# EAGLE design 8051 with lcd (EAGLE 6.5.0)
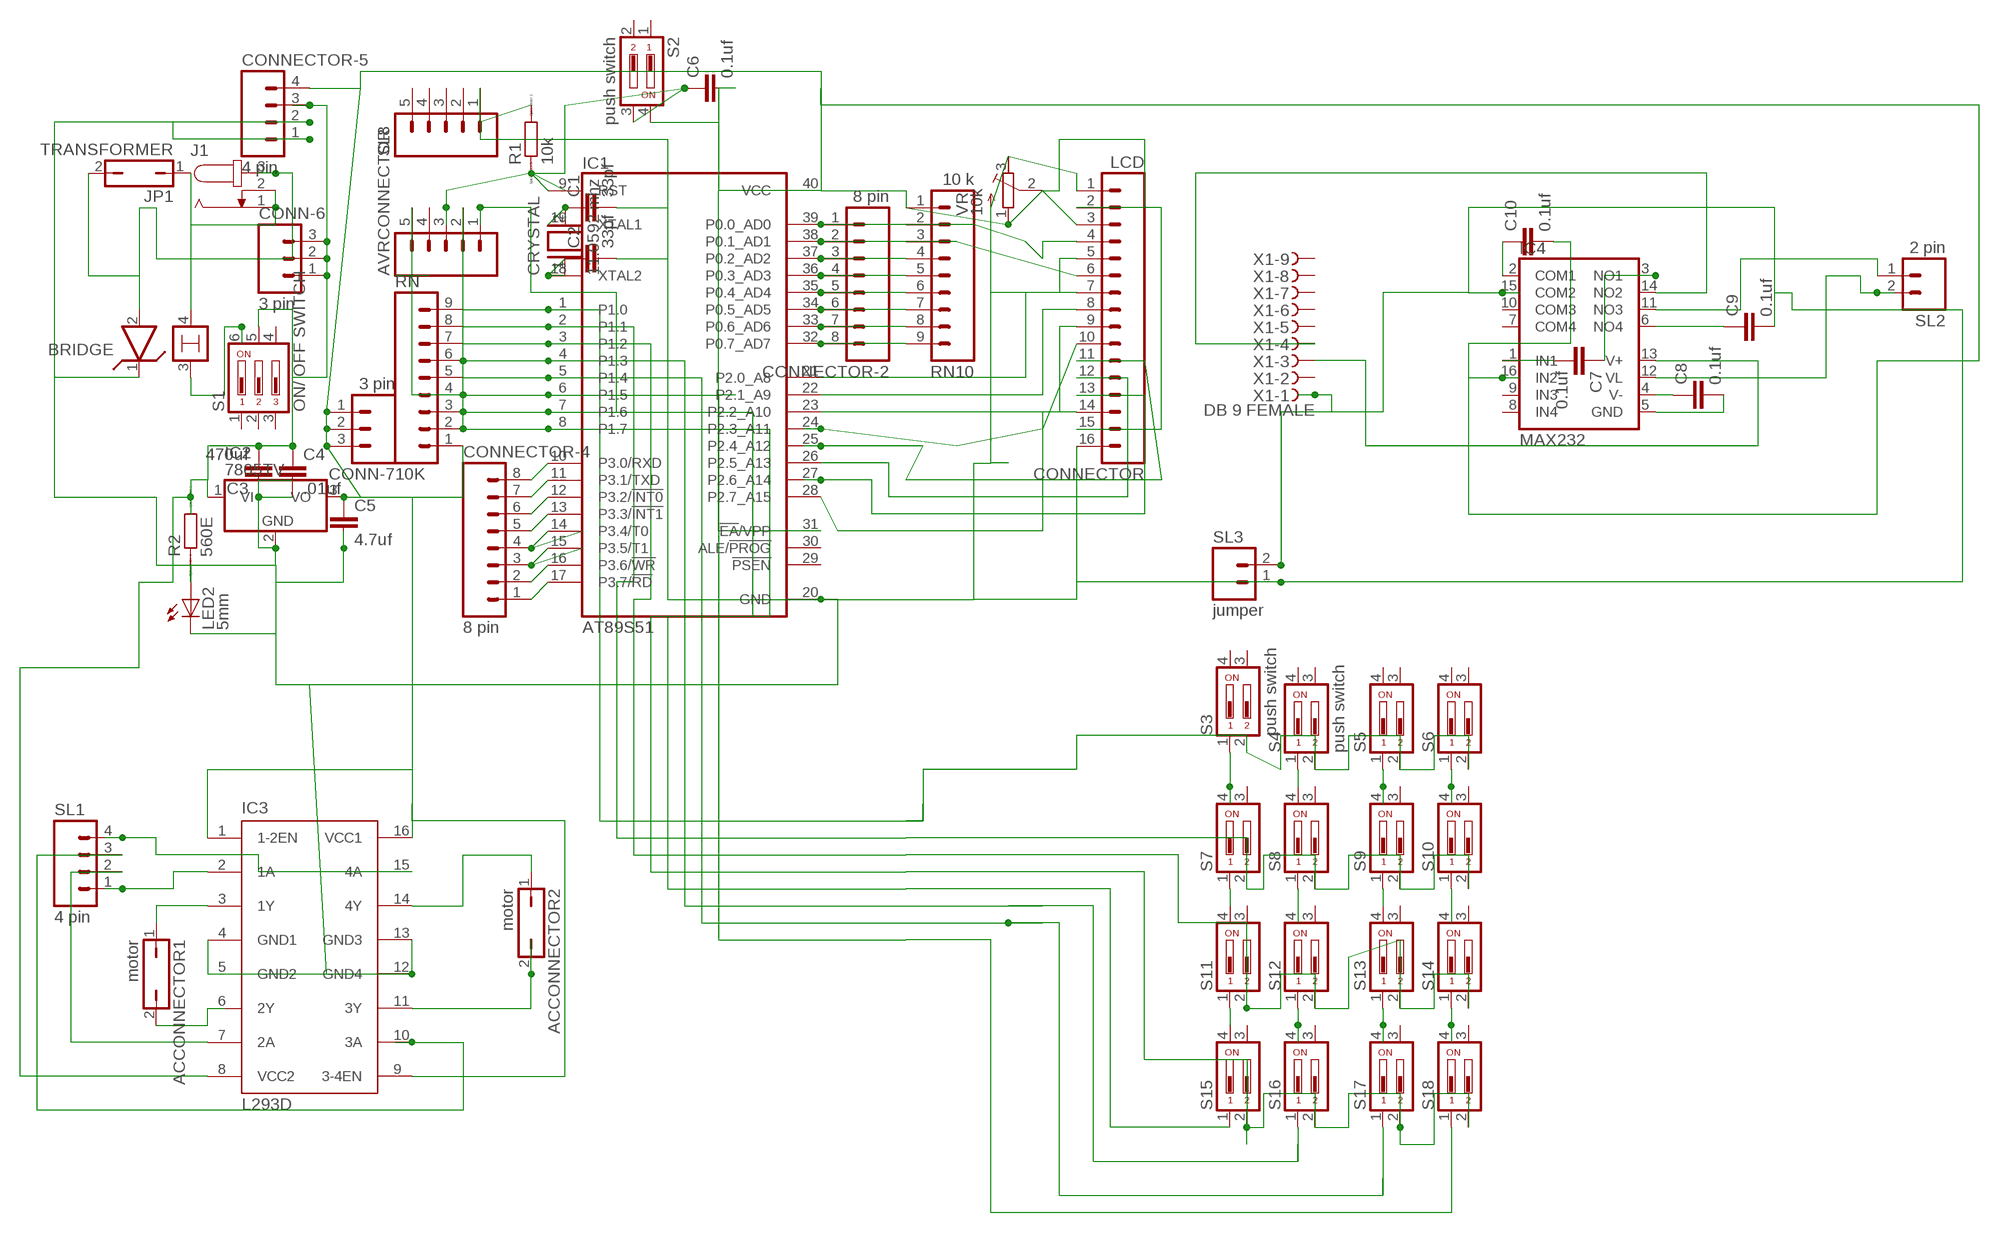
[diagram p0: schematic, sheet 1]

## Parts
ACCONNECTOR1  motor  JP1Q  [JP1]
ACCONNECTOR2  motor  JP1Q  [JP1]
AVRCONNECTOR  M05  [05P]
BRIDGE  LM399H  [TO39/4]
C1  33pf  C-EU025-024X044  [C025-024X044]
C2  33pf  C-EU025-024X044  [C025-024X044]
C3  470uf  C5/7.2  [C5B7.2]
C4  .01uf  C2,5-3  [C2.5-3]
C5  4.7uf  C2,5-3  [C2.5-3]
C6  0.1uf  C2.5/6  [C2.5-6]
C7  0.1uf  C2,5-3  [C2.5-3]
C8  0.1uf  C2,5-3  [C2.5-3]
C9  0.1uf  C2,5-3  [C2.5-3]
C10  0.1uf  C2,5-3  [C2.5-3]
CONN-6  3 pin  M03  [03P]
CONN-7  3 pin  M03  [03P]
CONNECTOR  LCD  M16  [16P]
CONNECTOR-2  8 pin  M08  [08P]
CONNECTOR-4  8 pin  M08  [08P]
CONNECTOR-5  4 pin  M04  [04P]
CRYSTAL  11.0592 mhz  XTAL/S  [QS]
IC1  AT89S51  AT89C51-12PC  [DIL40]
IC2  7805TV  [TO220V]
IC3  L293D  [DIL16]
IC4  MAX232  MAX313EPE  [DIL16]
J1  JACK-PLUG0  [SPC4077]
JP1  TRANSFORMER  JP1Q  [JP1]
LED2  5mm  LED5MM  [LED5MM]
R1  10k  R0204/7  [0204/7]
R2  560E  R0204/7  [0204/7]
RN  10K  M09  [09P]
RN10  10 k  M09  [09P]
S1  ON/ OFF SWITCH  DA03  [DA-03]
S2  push switch  DP02  [DP-02]
S3  push switch  DP02  [DP-02]
S4  push switch  DP02  [DP-02]
S5  DP02  [DP-02]
S6  DP02  [DP-02]
S7  DP02  [DP-02]
S8  DP02  [DP-02]
S9  DP02  [DP-02]
S10  DP02  [DP-02]
S11  DP02  [DP-02]
S12  DP02  [DP-02]
S13  DP02  [DP-02]
S14  DP02  [DP-02]
S15  DP02  [DP-02]
S16  DP02  [DP-02]
S17  DP02  [DP-02]
S18  DP02  [DP-02]
SL1  4 pin  M04  [04P]
SL2  2 pin  M02  [02P]
SL3  jumper  M02  [02P]
SL8  M05  [05P]
VR  10k  R-TRIMM64P  [RTRIM64P]
X1  DB 9 FEMALE  D-SUB9-H2M09ST  [H2M09ST]

## Nets
N$1: C2.1 CRYSTAL.1 IC1.18(XTAL2)
N$2: C1.1 CRYSTAL.2 IC1.19(XTAL1)
N$3: S3.2 S4.2 S5.2 S6.2
N$4: C7.2 IC4.1(IN1)
N$5: BRIDGE.2 J1.3 JP1.2
N$6: CONNECTOR-4.8 IC1.10(P3.0/RXD)
N$7: CONNECTOR-4.7 IC1.11(P3.1/TXD)
N$8: CONNECTOR-4.6 IC1.12(P3.2/!INT0)
N$9: CONNECTOR-4.5 IC1.13(P3.3/!INT1)
N$10: CONNECTOR-4.4 IC1.14(P3.4/T0)
N$11: CONNECTOR-4.3 IC1.15(P3.5/T1)
N$12: CONNECTOR-4.2 IC1.16(P3.6/!WR)
N$13: CONNECTOR-4.1 IC1.17(P3.7/!RD)
N$14: AVRCONNECTOR.3 C6.1 IC1.9(RST) R1.1 S2.3
N$15: AVRCONNECTOR.5 IC1.6(P1.5) RN.4
N$16: BRIDGE.4 J1.1 J1.2 JP1.1
N$17: IC1.5(P1.4) RN.5 S15.1
N$18: IC1.4(P1.3) RN.6 S15.2 S16.2 S17.2 S18.2
N$19: IC1.3(P1.2) RN.7 S11.2 S12.2 S13.2 S14.2
N$20: IC1.2(P1.1) RN.8 S7.2 S8.2 S9.2 S10.2
N$21: IC1.1(P1.0) RN.9
N$22: S16.1
N$23: C7.1 IC4.3(NO1)
N$24: CONNECTOR-2.3 IC1.37(P0.2_AD2) RN10.4
N$25: CONNECTOR-2.4 IC1.36(P0.3_AD3) RN10.5
N$26: CONNECTOR-2.5 IC1.35(P0.4_AD4) RN10.6
N$27: CONNECTOR-2.6 IC1.34(P0.5_AD5) RN10.7
N$28: CONNECTOR-2.7 IC1.33(P0.6_AD6) RN10.8
N$29: CONNECTOR-2.8 IC1.32(P0.7_AD7) RN10.9
N$30: CONNECTOR.7 IC1.21(P2.0_A8)
N$31: CONNECTOR.8 IC1.22(P2.1_A9)
N$32: CONNECTOR.9 IC1.23(P2.2_A10)
N$33: S3.1 S7.4
N$34: S7.1 S11.4
N$35: CONNECTOR.12 IC1.26(P2.5_A13)
N$36: S11.1 S15.4
N$37: S8.1 S12.4
N$38: CONNECTOR.3 VR.2(S)
N$40: S12.1 S16.4
N$41: IC3.2(1A) SL1.1
N$42: AVRCONNECTOR.1 IC1.7(P1.6) RN.3 S17.1
N$43: C3.2 C4.1 CONN-6.1 CONN-6.2 CONN-6.3 CONNECTOR-5.3 IC2.1(VI) IC3.8(VCC2) R2.2 S1.5
N$44: S13.1 S17.4
N$45: AVRCONNECTOR.2 IC1.8(P1.7) RN.2 S18.1
N$47: BRIDGE.3 S1.6
N$48: CONNECTOR-2.2 CONNECTOR.6 IC1.38(P0.1_AD1) RN10.3
N$49: S14.1 S18.4
N$50: S10.1 S14.4
N$51: CONNECTOR.10 IC1.24(P2.3_A11)
N$52: CONNECTOR.11 IC1.25(P2.4_A12)
N$53: C8.1 IC4.4(V-)
N$54: CONNECTOR.13 IC1.27(P2.6_A14)
N$55: CONNECTOR.14 IC1.28(P2.7_A15)
N$57: ACCONNECTOR1.1 IC3.3(1Y)
N$58: CONNECTOR-2.1 CONNECTOR.4 IC1.39(P0.0_AD0) RN10.2
N$59: ACCONNECTOR1.2 IC3.6(2Y)
N$60: ACCONNECTOR2.1 IC3.14(4Y)
N$61: ACCONNECTOR2.2 IC3.11(3Y)
N$62: S4.1 S8.4
N$63: S5.1 S9.4
N$64: S6.1 S10.4
N$65: S9.1 S13.4
N$66: IC3.7(2A) SL1.2
N$67: IC3.10(3A) SL1.3
N$68: IC3.15(4A) SL1.4
N$69: C8.2 IC4.5(GND)
N$70: C9.1 IC4.6(NO4)
N$71: LED2.A R2.1
N$72: BRIDGE.1 C1.2 C2.2 C3.1 C4.2 C5.2 C9.2 CONNECTOR-5.1 CONNECTOR-5.2 CONNECTOR.1 CONNECTOR.5 CONNECTOR.16 IC1.20(GND) IC2.2(GND) IC3.4(GND1) IC3.5(GND2) IC3.12(GND4) IC3.13(GND3) IC4.15(COM2) LED2.K(C) R1.2 SL3.1 SL3.2 SL8.1 VR.3(A) X1.1
N$73: C10.1 IC4.2(COM1)
N$74: C5.1 C6.2 C10.2 CONN-7.1 CONN-7.2 CONN-7.3 CONNECTOR-5.4 CONNECTOR.2 CONNECTOR.15 IC1.31(!EA!/VPP) IC1.40(VCC) IC2.3(VO) IC3.1(1-2EN) IC3.9(3-4EN) IC3.16(VCC1) IC4.16(IN2) RN10.1 RN.1 S2.4 VR.1(E)
N$75: IC4.13(V+) X1.3
N$76: IC4.14(NO2) X1.4
N$77: IC4.11(NO3) SL2.1
N$78: IC4.12(VL) SL2.2
Unconnected: AVRCONNECTOR.4 IC1.29(!PSEN) IC1.30(ALE/!PROG) IC4.7(COM4) IC4.8(IN4) IC4.9(IN3) IC4.10(COM3) S1.1 S1.2 S1.3 S1.4 S2.1 S2.2 S3.3 S3.4 S4.3 S4.4 S5.3 S5.4 S6.3 S6.4 S7.3 S8.3 S9.3 S10.3 S11.3 S12.3 S13.3 S14.3 S15.3 S16.3 S17.3 S18.3 SL8.2 SL8.3 SL8.4 SL8.5 X1.2 X1.5 X1.6 X1.7 X1.8 X1.9

## Library data of the parts
ACCONNECTOR1 ACCONNECTOR2 JP1 = jumper:JP1Q: JUMPER
AVRCONNECTOR SL8 = con-amp-quick:M05: AMP QUICK CONNECTOR; OC_FARNELL: unknown; OC_NEWARK: unknown
BRIDGE = linear:LM399H: Precision Z DIODE
C1 C2 = rcl:C-EU: CAPACITOR, European symbol
C3-C10 = capacitor-wima:C: CAPACITOR naming: grid - package width
CONN-6 CONN-7 = con-amp-quick:M03: AMP QUICK CONNECTOR; OC_FARNELL: unknown; OC_NEWARK: unknown
CONNECTOR = con-amp-quick:M16: AMP QUICK CONNECTOR; OC_FARNELL: unknown; OC_NEWARK: unknown
CONNECTOR-2 CONNECTOR-4 = con-amp-quick:M08: AMP QUICK CONNECTOR; OC_FARNELL: unknown; OC_NEWARK: unknown
CONNECTOR-5 SL1 = con-amp-quick:M04: AMP QUICK CONNECTOR; OC_FARNELL: unknown; OC_NEWARK: unknown
CRYSTAL = special:XTAL/S: CRYSTAL
IC1 = atmel:AT89C51-*: 8-bit Microcontroller with 4K Bytes Flash Not Recommended for New Designs. Use AT89S51. Source: http://www.atmel.com/dyn/resources/prod_documents/doc0265.; OC_FARNELL: unknown; OC_NEWARK: unknown
IC2 = linear:78*: Positive VOLTAGE REGULATOR Source: http://cache.national.com/ds/LM/LM78L05.pdf http://www.fairchildsemi.com/ds/LM/LM7805.pdf
IC3 = st-microelectronics:L293D: PUSH-PULL 4 CHANNEL DRIVER; MPN: L293D; OC_FARNELL: 9589619; OC_NEWARK: 56P8249
IC4 = maxim:MAX313: 10?, Quad, SPST, CMOS Analog Switches Source: http://datasheets.maxim-ic.com/en/ds/MAX312-MAX314.pdf; MPN: MAX313EPE+; OC_FARNELL: unknown; OC_NEWARK: 99K3220
J1 = con-jack:JACK-PLUG: DC POWER JACK Power Jack, DC, Right Angle, Through Hole, Rated 5A at 16VDC, PC Terminals Distributor: Farnell (www.Farnell.de) Drawing: 84N1161.pdf / 84N1162.pdf Manufacturer: SPC Technology (www.spctechnology.com) Type: SPC4077 / SPC 4078; OC_FARNELL: unknown; OC_NEWARK: unknown
LED2 = led:LED: LED OSRAM: - CHIPLED LG R971, LG N971, LY N971, LG Q971, LY Q971, LO R971, LY R971 LH N974, LH R974 LS Q976, LO Q976, LY Q976 LO Q996 - Hyper CHIPLED LW Q18S LB Q993, LB Q99A, LB R99A - SideLED LS A670, LO A670, LY A670, LG A670, LP A670 LB A673, LV A673, LT A673, LW A673 LH A674 LY A675 LS A676, LA A676, LO A676, LY A676, LW A676 LS A679, LY A679, LG A679 - Hyper Micro SIDELED® LS Y876, LA Y876, LO Y876, LY Y876 LT Y87S - SmartLED LW L88C, LW L88S LB L89C, LB L89S, LG L890 LS L89K, LO L89K, LY L89K LS L896, LA L896, LO L896, LY L896 - TOPLED LS T670, LO T670, LY T670, LG T670, LP T670 LSG T670, LSP T670, LSY T670, LOP T670, LYG T670 LG T671, LOG T671, LSG T671 LB T673, LV T673, LT T673, LW T673 LH T674 LS T676, LA T676, LO T676, LY T676, LB T676, LH T676, LSB T676, LW T676 LB T67C, LV T67C, LT T67C, LS T67K, LO T67K, LY T67K, LW E67C LS E67B, LA E67B, LO E67B, LY E67B, LB E67C, LV E67C, LT E67C LW T67C LS T679, LY T679, LG T679 LS T770, LO T770, LY T770, LG T770, LP T770 LB T773, LV T773, LT T773, LW T773 LH T774 LS E675, LA E675, LY E675, LS T675 LS T776, LA T776, LO T776, LY T776, LB T776 LHGB T686 LT T68C, LB T68C - Hyper Mini TOPLED® LB M676 - Mini TOPLED Santana® LG M470 LS M47K, LO M47K, LY M47K Source: http://www.osram.convergy.de LUXEON: - LUMILED® LXK2-PW12-R00, LXK2-PW12-S00, LXK2-PW14-U00, LXK2-PW14-V00 LXK2-PM12-R00, LXK2-PM12-S00, LXK2-PM14-U00 LXK2-PE12-Q00, LXK2-PE12-R00, LXK2-PE12-S00, LXK2-PE14-T00, LXK2-PE14-U00 LXK2-PB12-K00, LXK2-PB12-L00, LXK2-PB12-M00, LXK2-PB14-N00, LXK2-PB14-P00, LXK2-PB14-Q00 LXK2-PR12-L00, LXK2-PR12-M00, LXK2-PR14-Q00, LXK2-PR14-R00 LXK2-PD12-Q00, LXK2-PD12-R00, LXK2-PD12-S00 LXK2-PH12-R00, LXK2-PH12-S00 LXK2-PL12-P00, LXK2-PL12-Q00, LXK2-PL12-R00 Source: www.luxeon.com KINGBRIGHT: KA-3528ASYC Source: www.kingbright.com
R1 R2 = eagle-ltspice:R: RESISTOR, European symbol; SPICEMODEL: NONE; SPICEPREFIX: R
RN RN10 = con-amp-quick:M09: AMP QUICK CONNECTOR; OC_FARNELL: unknown; OC_NEWARK: unknown
S1 = switch-dil:DA03: DIL/CODE SWITCH; MPN: MCDA03; OC_FARNELL: 1521999; OC_NEWARK: 74M2972
S2-S18 = switch-dil:DP02: DIL/CODE SWITCH; MPN: MCDP02; OC_FARNELL: 1255233; OC_NEWARK: 26M1095
SL2 SL3 = con-amp-quick:M02: AMP QUICK CONNECTOR; OC_FARNELL: unknown; OC_NEWARK: unknown
VR = resistor:R-TRIMM: Trimm resistor
X1 = con-thomas-betts:D-SUB9-: D-Subminiatur Connector Source: Electronioc Interconnects European Edition 1998; OC_FARNELL: unknown; OC_NEWARK: unknown

## Board
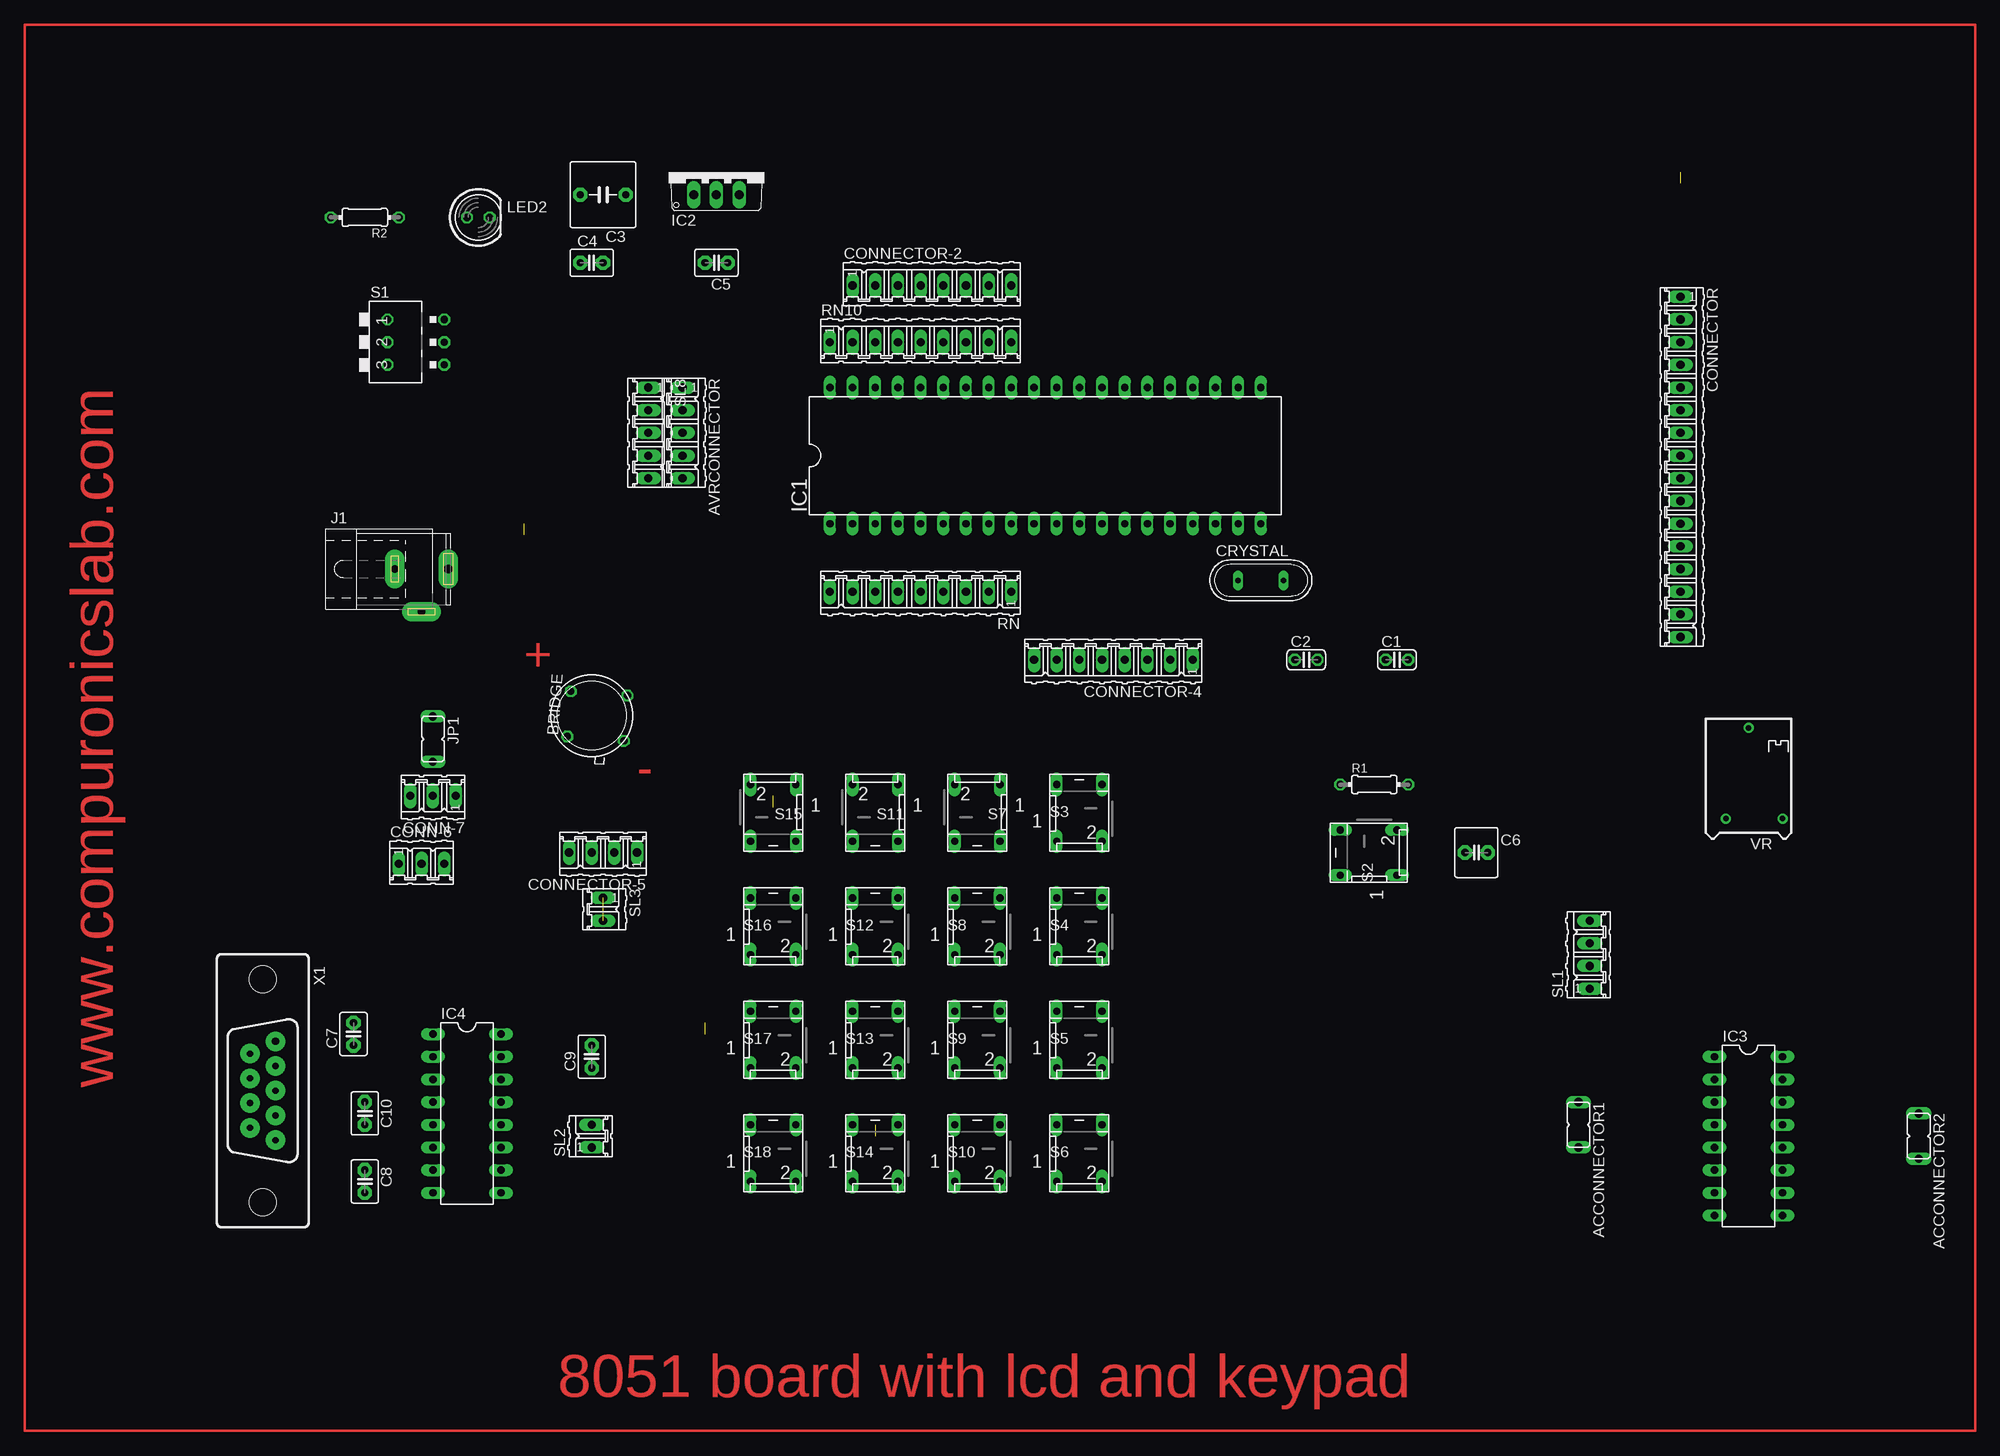
[diagram p1: board, top side]
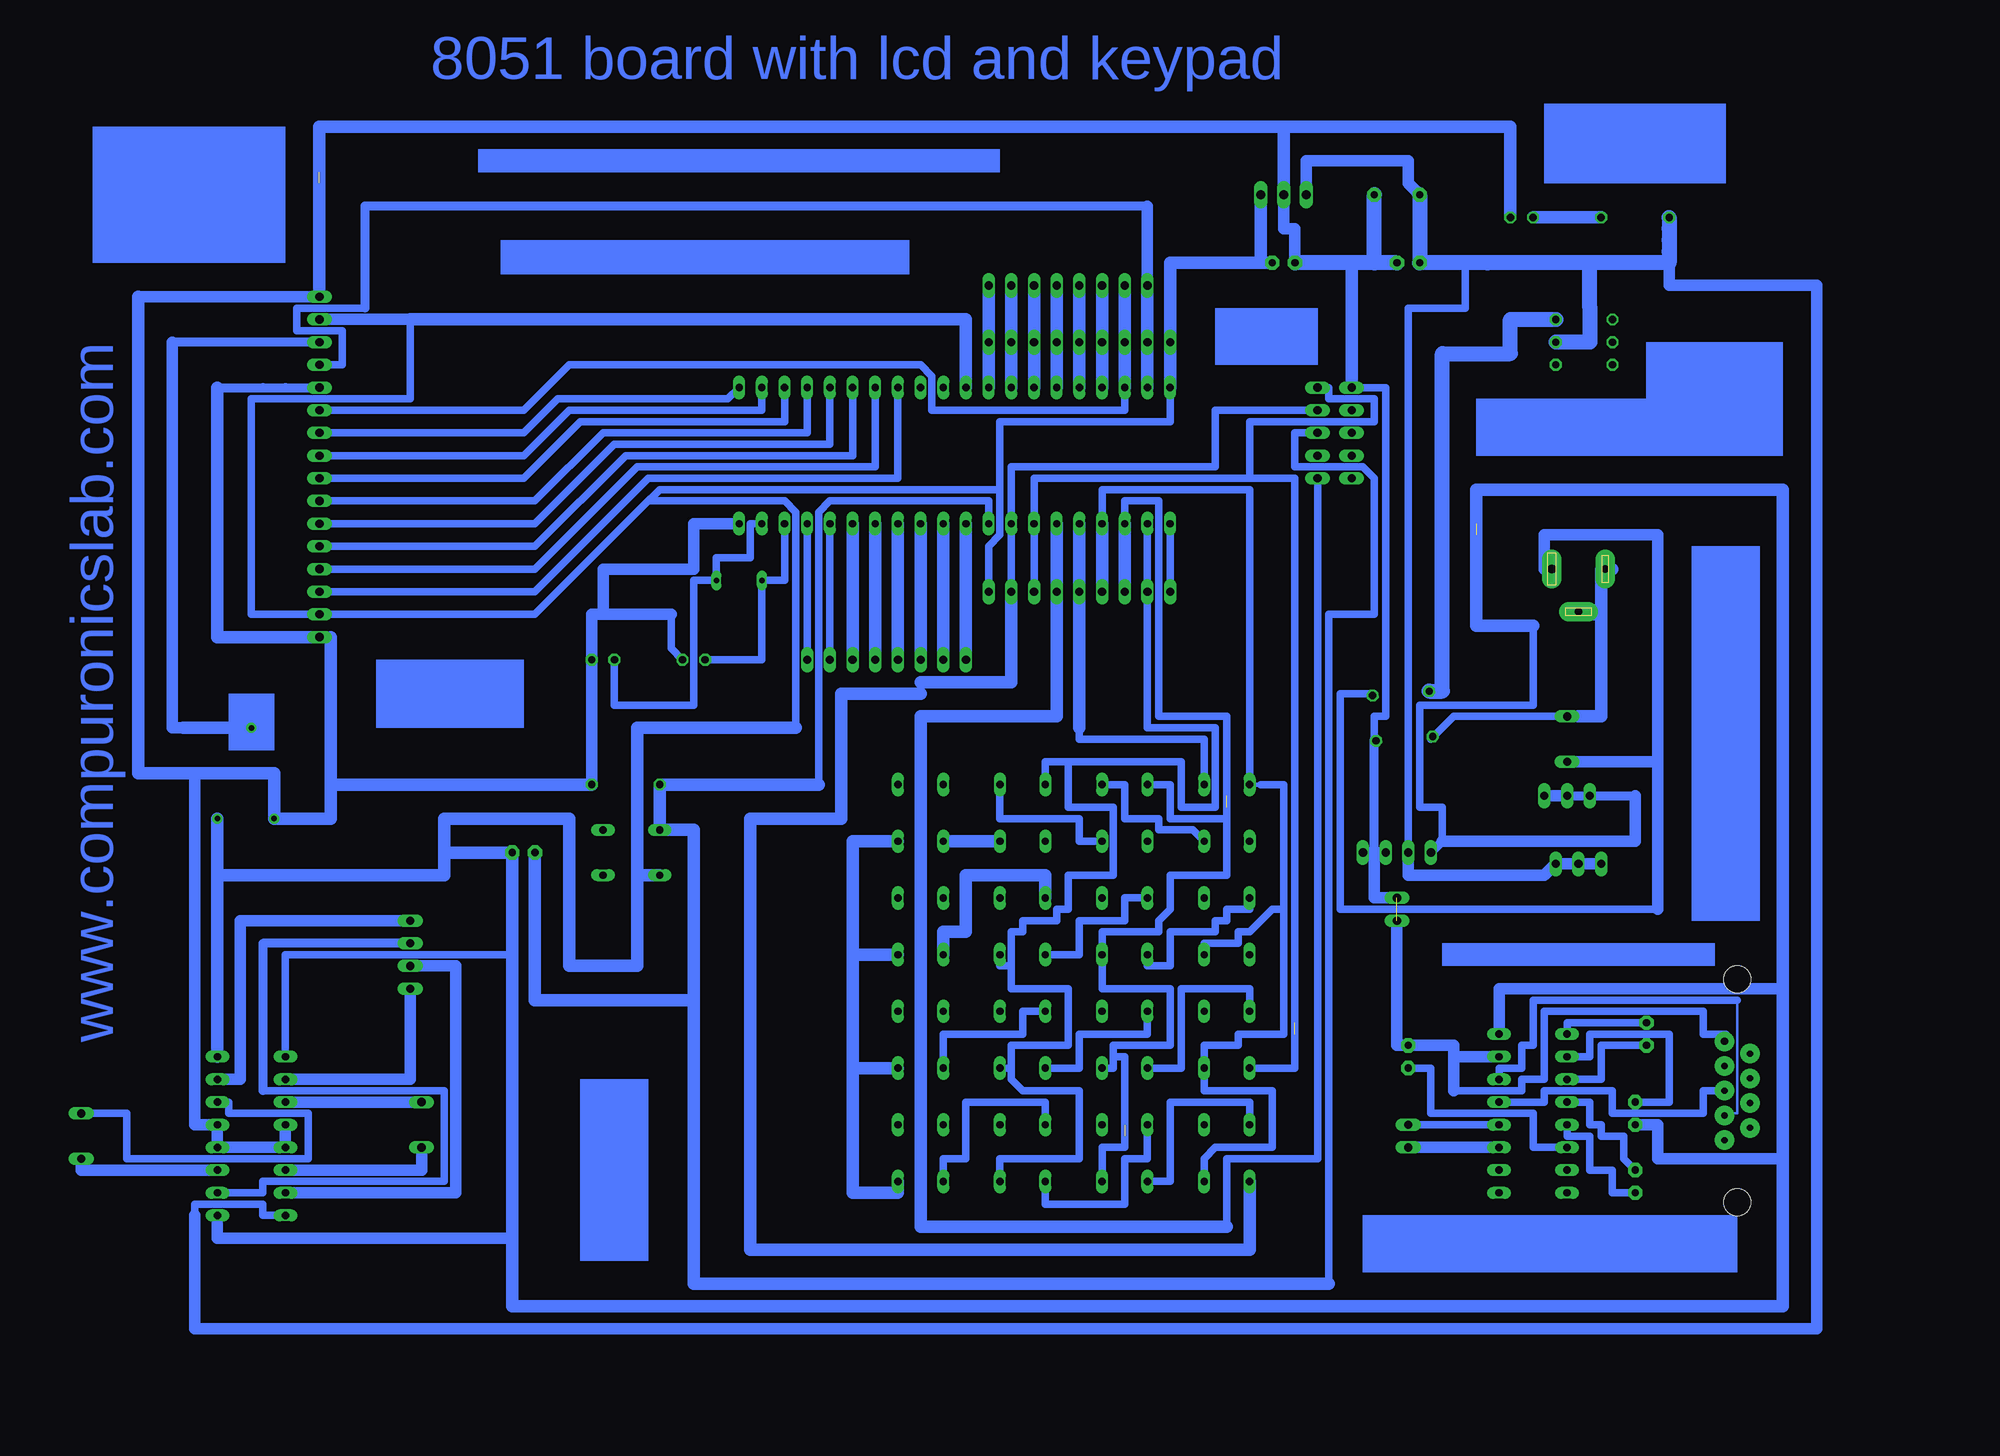
[diagram p2: board, bottom side, seen from below]

No outline drawn. Coordinates in mm, seen from the top.
Copper layers (1*16): Top 0.035mm / dielectric 1.5mm / Bottom 0.035mm
Design rules "default": minimum track width 20mil, minimum drill 24mil, track to track 20mil, track to pad 8mil, pad to pad 8mil, via to via 8mil, smd to smd 8mil, copper to edge 50mil, drill to drill 8mil, minimum pad ring 10mil, minimum via ring 8mil, stop-mask expansion 8mil, vias tented up to drill 0mil, thermal gap 20mil

### Footprints (pad centres in the part's own frame; a part is rotated, then mirrored left to right if it is on the bottom)
JP1 = drill 0.914 long: 1 0,-2.54; 2 0,2.54
05P = drill 0.914 long: 1 -5.08,0; 2 -2.54,0; 3 0,0; 4 2.54,0; 5 5.08,0
TO39/4 = drill 0.813 octagon: 1 -2.54,-2.54; 2 2.54,-2.54; 3 2.54,3.81; 4 -2.54,3.81
C025-024X044 = drill 0.813 octagon: 1 -1.27,0; 2 1.27,0
C5B7.2 = drill 0.813 pad 1.6 octagon: 1 -2.54,0; 2 2.54,0
C2.5-3 = drill 0.813 pad 1.6 octagon: 1 -1.27,0; 2 1.27,0
C2.5-6 = drill 0.813 pad 1.6 octagon: 1 -1.27,0; 2 1.27,0
03P = drill 0.914 long: 1 -2.54,0; 2 0,0; 3 2.54,0
16P = drill 0.914 long: 1 -19.05,0; 2 -16.51,0; 3 -13.97,0; 4 -11.43,0; 5 -8.89,0; 6 -6.35,0; 7 -3.81,0; 8 -1.27,0; 9 1.27,0; 10 3.81,0; 11 6.35,0; 12 8.89,0; 13 11.43,0; 14 13.97,0; 15 16.51,0; 16 19.05,0
08P = drill 0.914 long: 1 -8.89,0; 2 -6.35,0; 3 -3.81,0; 4 -1.27,0; 5 1.27,0; 6 3.81,0; 7 6.35,0; 8 8.89,0
04P = drill 0.914 long: 1 -3.81,0; 2 -1.27,0; 3 1.27,0; 4 3.81,0
QS = drill 0.61 long: 1 -2.54,0; 2 2.54,0
DIL40 = drill 0.813 long: 1 -24.13,-7.62; 2 -21.59,-7.62; 3 -19.05,-7.62; 4 -16.51,-7.62; 5 -13.97,-7.62; 6 -11.43,-7.62; 7 -8.89,-7.62; 8 -6.35,-7.62; 9 -3.81,-7.62; 10 -1.27,-7.62; 11 1.27,-7.62; 12 3.81,-7.62; 13 6.35,-7.62; 14 8.89,-7.62; 15 11.43,-7.62; 16 13.97,-7.62; 17 16.51,-7.62; 18 19.05,-7.62; 19 21.59,-7.62; 20 24.13,-7.62; 21 24.13,7.62; 22 21.59,7.62; 23 19.05,7.62; 24 16.51,7.62; 25 13.97,7.62; 26 11.43,7.62; 27 8.89,7.62; 28 6.35,7.62; 29 3.81,7.62; 30 1.27,7.62; 31 -1.27,7.62; 32 -3.81,7.62; 33 -6.35,7.62; 34 -8.89,7.62; 35 -11.43,7.62; 36 -13.97,7.62; 37 -16.51,7.62; 38 -19.05,7.62; 39 -21.59,7.62; 40 -24.13,7.62
TO220V = drill 1.016 long: 1 -2.54,-2.54; 2 0,-2.54; 3 2.54,-2.54
DIL16 = drill 0.813 long: 1 -8.89,-3.81; 2 -6.35,-3.81; 3 -3.81,-3.81; 4 -1.27,-3.81; 5 1.27,-3.81; 6 3.81,-3.81; 7 6.35,-3.81; 8 8.89,-3.81; 9 8.89,3.81; 10 6.35,3.81; 11 3.81,3.81; 12 1.27,3.81; 13 -1.27,3.81; 14 -3.81,3.81; 15 -6.35,3.81; 16 -8.89,3.81
SPC4077 = drill 0.8 pad 2.184 long: 1 -3,0; 2 0,-4.8 | drill 1 pad 2.184 long: 3 3,0
LED5MM = drill 0.813 octagon: A -1.27,0; K 1.27,0
0204/7 = drill 0.813 octagon: 1 -3.81,0; 2 3.81,0
09P = drill 0.914 long: 1 -10.16,0; 2 -7.62,0; 3 -5.08,0; 4 -2.54,0; 5 0,0; 6 2.54,0; 7 5.08,0; 8 7.62,0; 9 10.16,0
DA-03 = drill 0.813 octagon: 1 -2.54,-5.08; 2 0,-5.08; 3 2.54,-5.08; 4 2.54,1.27; 5 0,1.27; 6 -2.54,1.27
DP-02 = drill 0.813 long: 1 -2.54,-2.54; 2 2.54,-2.54; 3 2.54,3.81; 4 -2.54,3.81
02P = drill 0.914 long: 1 -1.27,0; 2 1.27,0
RTRIM64P = drill 0.61: 1 -2.54,-3.81; 2 7.62,0; 3 -2.54,2.54
H2M09ST = drill 0.8 pad 2.184: 1 -5.537,1.422 | drill 0.7 pad 2.184: 2 -2.769,1.422; 3 0,1.422; 4 2.769,1.422; 5 5.537,1.422; 6 -4.153,-1.422; 7 -1.384,-1.422; 8 1.384,-1.422; 9 4.153,-1.422 | hole 3.048: -12.497,0; 12.497,0

### Placement (x,y rotation side)
ACCONNECTOR1  113.03,-29.21 180 top
ACCONNECTOR2  151.13,-30.48 180 top
AVRCONNECTOR  12.7,48.26 270 top
BRIDGE  3.81,16.51 85.6 top
C1  92.71,22.86 0 top
C2  82.55,22.86 0 top
C3  3.81,74.93 180 top
C4  2.54,67.31 0 top
C5  16.51,67.31 180 top
C6  101.6,1.27 0 top
C7  -24.13,-19.05 90 top
C8  -22.86,-35.56 270 top
C9  2.54,-21.59 90 top
C10  -22.86,-27.94 270 top
CONN-6  -16.51,0 0 top
CONN-7  -15.24,7.62 180 top
CONNECTOR  124.46,44.45 270 top
CONNECTOR-2  40.64,64.77 0 top
CONNECTOR-4  60.96,22.86 180 top
CONNECTOR-5  3.81,1.27 180 top
CRYSTAL  77.47,31.75 0 top
IC1  53.34,45.72 0 top
IC2  16.51,77.47 0 top
IC3  132.08,-30.48 270 top
IC4  -11.43,-27.94 270 top
J1  -16.51,33.02 0 top
JP1  -15.24,13.97 180 top
LED2  -10.16,72.39 0 top
R1  90.17,8.89 0 top
R2  -22.86,72.39 180 top
RN  39.37,30.48 180 top
RN10  39.37,58.42 0 top
S1  -15.24,58.42 270 top
S2  90.17,1.27 90 top
S3  57.15,5.08 0 top
S4  57.15,-7.62 0 top
S5  57.15,-20.32 0 top
S6  57.15,-33.02 0 top
S7  45.72,6.35 180 top
S8  45.72,-7.62 0 top
S9  45.72,-20.32 0 top
S10  45.72,-33.02 0 top
S11  34.29,6.35 180 top
S12  34.29,-7.62 0 top
S13  34.29,-20.32 0 top
S14  34.29,-33.02 0 top
S15  22.86,6.35 180 top
S16  22.86,-7.62 0 top
S17  22.86,-20.32 0 top
S18  22.86,-33.02 0 top
SL1  114.3,-10.16 90 top
SL2  2.54,-30.48 90 top
SL3  3.81,-5.08 270 top
SL8  8.89,48.26 270 top
VR  132.08,7.62 90 top
X1  -34.29,-25.4 270 top

### Tracks (layer width: path | path; a pad name or v marks a point on that pad's centre or on a via)
N$1
  Bottom 0.813: C2.1 74.93,22.86 CRYSTAL.1 72.39,31.75 IC1.18
N$2
  Bottom 0.813: IC1.19 76.2,38.1 76.2,35.56 76.2,34.29 80.01,34.29 CRYSTAL.2 82.55,31.75 82.55,21.59 82.55,17.78 91.44,17.78 C1.1
N$3
  Bottom 0.406: 64.77,-10.16 60.96,-10.16 S4.2 | 64.77,-22.86 S5.2
  Bottom 1.422: S3.2 64.77,2.54 64.77,-10.16 | S4.2 64.77,-10.16 | 64.77,-10.16 64.77,-22.86 | S5.2 64.77,-22.86 | 64.77,-22.86 64.77,-36.83 59.69,-36.83 S6.2
N$4
  Bottom 0.813: IC4.1 -15.24,-17.78 -16.51,-17.78 C7.2
N$5
  Bottom 0.406: -25.4,-2.54 -25.4,-3.81 | -25.4,-3.81 -25.4,-5.08 -25.4,-3.81
  Bottom 0.508: -21.59,11.43 -25.4,11.43 | 6.35,19.05 BRIDGE.2 | -13.97,33.02 J1.3
  Bottom 0.813: 6.35,19.05 8.89,19.05 10.16,19.05 10.16,-5.08 | 10.16,-5.08 1.27,-5.08 | 1.27,-5.08 10.16,-5.08 | 1.27,-5.08 -19.05,-5.08 -25.4,-5.08 -25.4,-3.81 -25.4,-2.54 | 1.27,-5.08 10.16,-5.08
  Bottom 1.27: -25.4,11.43 -25.4,-2.54 | -25.4,-2.54 -25.4,-3.81 | -25.4,-3.81 -25.4,-5.08 | -25.4,-5.08 -25.4,-3.81 | -25.4,-3.81 -25.4,-2.54 | -25.4,-2.54 -25.4,-3.81 | -25.4,-3.81 -25.4,-5.08 | -25.4,-5.08 -25.4,-3.81 | -25.4,-3.81 -25.4,-2.54 | -25.4,-2.54 -25.4,-3.81 | JP1.2 -21.59,11.43 -25.4,11.43 | -25.4,11.43 -25.4,34.29 -25.4,36.83 -21.59,36.83 -19.05,36.83 -17.78,36.83 -12.7,36.83 -12.7,33.02 J1.3
N$6
  Bottom 1.422: CONNECTOR-4.8 IC1.10
N$7
  Bottom 1.422: CONNECTOR-4.7 IC1.11
N$8
  Bottom 1.422: CONNECTOR-4.6 IC1.12
N$9
  Bottom 1.422: CONNECTOR-4.5 IC1.13
N$10
  Bottom 1.422: CONNECTOR-4.4 IC1.14
N$11
  Bottom 1.422: CONNECTOR-4.3 IC1.15
N$12
  Bottom 0.813: CONNECTOR-4.2 IC1.16
N$13
  Bottom 0.813: CONNECTOR-4.1 IC1.17
N$14
  Bottom 0.508: 82.55,-15.24 82.55,-7.62
  Bottom 0.813: IC1.9 49.53,39.37 49.53,40.64 52.07,40.64 67.31,40.64 68.58,39.37 68.58,8.89 | AVRCONNECTOR.3 15.24,48.26 15.24,44.45 7.62,44.45 6.35,43.18 6.35,27.94 11.43,27.94 11.43,24.13 11.43,20.32 11.43,16.51 11.43,-41.91 11.43,-46.99
  Bottom 1.422: 68.58,8.89 R1.1 S2.3 82.55,3.81 82.55,0 82.55,-7.62 82.55,-46.99 11.43,-46.99 | C6.1 100.33,-15.24 82.55,-15.24
N$15
  Bottom 0.813: AVRCONNECTOR.5 12.7,-33.02 20.32,-33.02 21.59,-33.02 22.86,-33.02 22.86,-39.37 22.86,-40.64
  Bottom 1.422: IC1.6 RN.4 41.91,27.94 41.91,19.05 41.91,16.51 55.88,16.51 57.15,16.51 57.15,-39.37 57.15,-40.64 22.86,-40.64
N$16
  Bottom 0.508: -20.32,33.02 J1.1 | 0,13.97 BRIDGE.4
  Bottom 0.813: 0,13.97 -2.54,16.51 JP1.1
  Bottom 1.27: -19.05,27.94 -16.51,27.94 J1.2 -19.05,27.94 | -19.05,27.94 -19.05,29.21 -19.05,27.94 | JP1.1 -16.51,16.51
  Bottom 1.422: -20.32,33.02 -19.05,33.02 -19.05,29.21 | -16.51,16.51 -19.05,16.51 -19.05,27.94 | -19.05,27.94 -19.05,29.21 | -19.05,29.21 -19.05,27.94 | -19.05,27.94 -16.51,27.94
N$17
  Bottom 0.813: S15.1 25.4,11.43 25.4,13.97 30.48,13.97 33.02,13.97 39.37,13.97 39.37,15.24
  Bottom 1.422: 39.37,15.24 39.37,20.32 RN.5 IC1.5
N$18
  Bottom 0.508: S15.2 19.05,8.89
  Bottom 0.813: S16.2 25.4,-8.89 24.13,-8.89 21.59,-8.89 21.59,-7.62 20.32,-7.62 17.78,-5.08 16.51,-5.08 | IC1.4 36.83,41.91 33.02,41.91 30.48,41.91 27.94,41.91 20.32,41.91 20.32,31.75 S15.2 | 19.05,8.89 16.51,8.89 16.51,-5.08 | 16.51,-5.08 16.51,-19.05 17.78,-19.05 19.05,-19.05 21.59,-19.05 21.59,-20.32 25.4,-20.32 S17.2 25.4,-25.4 17.78,-25.4 17.78,-29.21 17.78,-31.75 20.32,-31.75 24.13,-31.75 25.4,-33.02 S18.2
  Bottom 1.422: RN.6 IC1.4
N$19  (2 unrouted)
  Bottom 0.508: 35.56,-22.86 35.56,-21.59 | 22.86,11.43 22.86,7.62
  Bottom 0.813: S14.2 36.83,-31.75 34.29,-31.75 34.29,-29.21 | 35.56,-21.59 34.29,-21.59 34.29,-30.48 | S13.2 35.56,-22.86 35.56,-20.32 33.02,-20.32 30.48,-20.32 29.21,-20.32 29.21,-13.97 30.48,-13.97 31.75,-13.97 33.02,-13.97 36.83,-13.97 S12.2 36.83,-7.62 34.29,-7.62 31.75,-7.62 30.48,-7.62 30.48,-6.35 29.21,-5.08 29.21,-1.27 25.4,-1.27 24.13,-1.27 22.86,-1.27 22.86,6.35 | S11.2 29.21,8.89 29.21,6.35 29.21,5.08 27.94,5.08 25.4,5.08 22.86,5.08 22.86,11.43 | IC1.3 34.29,40.64 31.75,40.64 30.48,40.64 30.48,39.37 30.48,16.51 27.94,16.51 22.86,16.51 22.86,7.62
  Bottom 1.422: RN.7 IC1.3
N$20
  Bottom 0.508: 46.99,-22.86 46.99,-24.13 | 40.64,11.43 40.64,7.62
  Bottom 0.813: IC1.2 RN.8 31.75,15.24 29.21,15.24 24.13,15.24 24.13,10.16 24.13,6.35 26.67,6.35 27.94,6.35 27.94,11.43 31.75,11.43 38.1,11.43 40.64,11.43 | S10.2 48.26,-33.02 41.91,-33.02 39.37,-33.02 39.37,-25.4 40.64,-25.4 41.91,-25.4 45.72,-25.4 46.99,-24.13 46.99,-20.32 44.45,-20.32 41.91,-20.32 40.64,-20.32 40.64,-13.97 41.91,-13.97 43.18,-13.97 44.45,-13.97 46.99,-13.97 46.99,-11.43 | S9.2 46.99,-22.86 | 46.99,-11.43 48.26,-11.43 S8.2 | 40.64,11.43 40.64,6.35 38.1,6.35 35.56,6.35 35.56,3.81 35.56,-1.27 36.83,-1.27 40.64,-1.27 40.64,-5.08 41.91,-5.08 41.91,-6.35 45.72,-6.35 45.72,-7.62 46.99,-7.62 46.99,-11.43 | S7.2 43.18,11.43 40.64,11.43 | 40.64,7.62 40.64,11.43
N$21
  Bottom 0.813: RN.9 IC1.1
N$23
  Bottom 0.813: IC4.3 -19.05,-24.13 -19.05,-20.32 C7.1
N$24
  Bottom 1.422: IC1.37 RN10.4 CONNECTOR-2.3
N$25
  Bottom 1.422: IC1.36 RN10.5 CONNECTOR-2.4
N$26
  Bottom 1.422: IC1.35 RN10.6 CONNECTOR-2.5
N$27
  Bottom 1.422: IC1.34 RN10.7 CONNECTOR-2.6
N$28
  Bottom 1.422: IC1.33 RN10.8 CONNECTOR-2.7
N$29
  Bottom 1.422: IC1.32 RN10.9 CONNECTOR-2.8
N$30
  Bottom 0.813: IC1.21 78.74,52.07 97.79,52.07 101.6,48.26 CONNECTOR.7
N$31
  Bottom 0.813: IC1.22 74.93,50.8 77.47,50.8 96.52,50.8 101.6,45.72 CONNECTOR.8
N$32
  Bottom 0.813: IC1.23 72.39,49.53 76.2,49.53 95.25,49.53 101.6,43.18 CONNECTOR.9
N$33
  Bottom 1.422: S3.1 S7.4
N$34
  Bottom 0.813: S11.4 39.37,2.54 39.37,5.08 44.45,5.08 48.26,5.08 S7.1
N$35
  Bottom 0.813: IC1.26 64.77,45.72 72.39,45.72 90.17,45.72 100.33,35.56 CONNECTOR.12
N$36
  Bottom 0.813: S15.4 26.67,3.81 30.48,3.81 30.48,5.08 34.29,5.08 34.29,8.89 35.56,8.89 S11.1
N$37
  Bottom 0.813: S8.1 39.37,-10.16 39.37,-6.35 34.29,-6.35 34.29,-3.81 S12.4
N$38
  Bottom 1.016: 140.97,58.42 133.35,58.42 129.54,58.42 CONNECTOR.3
  Bottom 1.27: 140.97,24.13 140.97,15.24 | 140.97,15.24 139.7,15.24 | 139.7,15.24 134.62,15.24 VR.2 139.7,15.24 | 140.97,58.42 140.97,24.13 | 140.97,24.13 140.97,15.24
  Bottom 1.422: 139.7,15.24 VR.2 | VR.2 134.62,15.24 VR.2
N$39
  Top 0.254: -60.96,93.98 157.48,93.98 157.48,-63.5 -60.96,-63.5 -60.96,87.63 -60.96,93.98
N$40
  Bottom 0.813: S16.4 20.32,-5.08 22.86,-5.08 22.86,-6.35 24.13,-6.35 24.13,-7.62 29.21,-7.62 29.21,-11.43 31.75,-11.43 S12.1
N$41
  Bottom 1.27: SL1.1 114.3,-24.13 118.11,-24.13 IC3.2
N$42  (1 unrouted)
  Bottom 0.508: 17.78,-22.86 15.24,-22.86 15.24,-17.78 | 17.78,43.18 19.05,43.18
  Bottom 0.813: 15.24,-17.78 15.24,-22.86 S17.1 | 19.05,43.18 15.24,43.18 15.24,-19.05 | 20.32,43.18 39.37,43.18 44.45,43.18 IC1.7 RN.3 | 20.32,43.18 17.78,43.18 | AVRCONNECTOR.1 11.43,53.34 11.43,52.07 7.62,52.07 6.35,52.07 6.35,50.8 6.35,49.53 13.97,49.53 20.32,49.53 20.32,43.18
N$43
  Bottom 0.508: -17.78,67.31 -17.78,62.23 | -3.81,62.23 -3.81,67.31 | 130.81,-39.37 IC3.8 130.81,-39.37
  Bottom 0.813: -3.81,67.31 -3.81,62.23 2.54,62.23 CONNECTOR-5.3 | IC3.8 130.81,-39.37 130.81,-38.1 137.16,-38.1 138.43,-38.1 138.43,-39.37
  Bottom 1.27: CONN-6.1 CONN-6.2 CONN-6.3 -12.7,-1.27 0,-1.27 2.54,-1.27 CONNECTOR-5.3 | IC2.1 13.97,78.74 2.54,78.74 2.54,76.2 C3.2 | 138.43,-39.37 138.43,-52.07 -29.21,-52.07 -43.18,-52.07 | -43.18,-52.07 -43.18,-45.72 -43.18,-52.07 | -43.18,-52.07 -43.18,64.77 -26.67,64.77 -26.67,67.31
  Bottom 1.676: C3.2 C4.1 -3.81,67.31 -6.35,67.31 -17.78,67.31 | -17.78,67.31 -26.67,67.31 -26.67,68.58 -26.67,69.85 -26.67,71.12 R2.2 | S1.5 -17.78,58.42 -17.78,62.23 -17.78,67.31
N$44
  Bottom 0.813: S13.1 27.94,-22.86 27.94,-13.97 20.32,-13.97 S17.4
N$45
  Bottom 0.508: 57.15,20.32 57.15,19.05 | 24.13,49.53 24.13,50.8 22.86,50.8
  Bottom 0.813: RN.2 IC1.8 46.99,44.45 41.91,44.45 40.64,44.45 35.56,44.45 29.21,44.45 24.13,44.45 24.13,49.53 24.13,50.8 AVRCONNECTOR.2
  Bottom 1.422: S18.1 20.32,-43.18 76.2,-43.18 76.2,5.08 68.58,5.08 66.04,5.08 66.04,19.05 57.15,19.05 | 57.15,20.32 52.07,20.32 46.99,20.32 46.99,25.4 RN.2
N$47
  Bottom 1.27: S1.6 -10.16,60.96 S1.6
  Bottom 1.676: BRIDGE.3 -1.27,19.34 -1.27,57.15 -8.89,57.15 -8.89,60.96 -10.16,60.96 S1.6
N$48
  Bottom 0.813: CONNECTOR.6 101.6,50.8 96.52,55.88 57.15,55.88 55.88,54.61 55.88,50.8 36.83,50.8 35.56,50.8 34.29,50.8 IC1.38
  Bottom 1.422: IC1.38 RN10.3 CONNECTOR-2.2
N$49
  Bottom 0.813: S18.4 20.32,-26.67 26.67,-26.67 29.21,-26.67 29.21,-35.56 S14.1
N$50
  Bottom 0.813: S10.1 43.18,-38.1 40.64,-38.1 36.83,-38.1 34.29,-38.1 34.29,-33.02 31.75,-33.02 S14.4
N$51
  Bottom 0.813: IC1.24 69.85,48.26 74.93,48.26 92.71,48.26 100.33,40.64 CONNECTOR.10
N$52
  Bottom 0.813: IC1.25 67.31,49.53 67.31,46.99 73.66,46.99 91.44,46.99 100.33,38.1 CONNECTOR.11
N$53
  Bottom 0.813: IC4.4 -17.78,-26.67 -17.78,-29.21 -19.05,-29.21 -19.05,-30.48 -21.59,-30.48 -21.59,-33.02 C8.1
N$54
  Bottom 0.813: IC1.27 62.23,48.26 62.23,44.45 71.12,44.45 88.9,44.45 100.33,33.02 CONNECTOR.13
N$55
  Bottom 0.813: IC1.28 59.69,46.99 59.69,43.18 69.85,43.18 87.63,43.18 100.33,30.48 CONNECTOR.14
N$57
  Bottom 1.27: ACCONNECTOR1.1 IC3.3
N$58
  Bottom 0.813: CONNECTOR.4 121.92,55.88 121.92,58.42 121.92,59.69 125.73,59.69 127,59.69 127,60.96 127,62.23 119.38,62.23
  Bottom 1.016: 119.38,62.23 119.38,73.66 54.61,73.66 31.75,73.66
  Bottom 1.27: CONNECTOR-2.1 31.75,73.66
  Bottom 1.422: IC1.39 RN10.2 CONNECTOR-2.1
N$59
  Bottom 1.27: IC3.6 115.57,-34.29 113.03,-34.29 113.03,-33.02 ACCONNECTOR1.2
N$60
  Bottom 0.813: IC3.14 134.62,-26.67 134.62,-27.94 127,-27.94 125.73,-27.94 125.73,-29.21 125.73,-33.02 146.05,-33.02 146.05,-27.94 ACCONNECTOR2.1
N$61
  Bottom 1.27: IC3.11 149.86,-34.29 151.13,-34.29 ACCONNECTOR2.2
N$62
  Bottom 1.422: S8.4 43.18,-1.27 46.99,-1.27 52.07,-1.27 52.07,-7.62 53.34,-7.62 54.61,-7.62 S4.1
N$63
  Bottom 0.813: S5.1 54.61,-19.05 50.8,-19.05 45.72,-19.05 45.72,-16.51 S9.4
N$64
  Bottom 0.813: S10.4 43.18,-26.67 46.99,-26.67 52.07,-26.67 52.07,-33.02 54.61,-33.02 S6.1
N$65
  Bottom 0.813: S13.4 31.75,-19.05 39.37,-19.05 39.37,-20.32 39.37,-22.86 S9.1
N$66
  Bottom 1.27: IC3.7 113.03,-36.83 109.22,-36.83 109.22,-35.56 109.22,-33.02 109.22,-11.43 SL1.2
N$67
  Bottom 0.813: IC3.10 130.81,-36.83 130.81,-35.56 114.3,-35.56 110.49,-35.56 110.49,-34.29 110.49,-31.75 110.49,-25.4 129.54,-25.4 130.81,-25.4
  Bottom 1.016: 130.81,-25.4 130.81,-24.13 130.81,-8.89 SL1.3
N$68
  Bottom 1.016: 133.35,-19.05 133.35,-20.32 133.35,-19.05
  Bottom 1.27: IC3.15 134.62,-24.13 133.35,-24.13 133.35,-20.32 133.35,-19.05 133.35,-6.35 132.08,-6.35 SL1.4
N$69
  Bottom 0.813: IC4.5 -15.24,-30.48 -17.78,-30.48 -17.78,-34.29 -20.32,-34.29 -20.32,-36.83 C8.2
N$70
  Bottom 0.813: IC4.6 -11.43,-31.75 -11.43,-27.94 -2.54,-27.94 0,-27.94 0,-22.86 C9.1
N$71
  Bottom 1.422: LED2.A R2.1
N$72  (2 unrouted)
  Bottom 0.508: 93.98,27.94 90.17,27.94 | CONNECTOR.16 123.19,25.4 | 16.51,77.47 16.51,80.01 16.51,82.55 | -2.54,-20.32 -2.54,-21.59 | 6.35,13.97 BRIDGE.1 6.35,13.97
  Bottom 0.813: C2.2 85.09,24.13 85.09,27.94 | 6.35,13.97 6.35,16.51 5.08,16.51 5.08,17.78 5.08,53.34 SL8.1 | -2.54,-25.4 -6.35,-25.4 -8.89,-25.4 -10.16,-25.4 -10.16,-24.13 -12.7,-24.13 -12.7,-19.05 -12.7,-16.51 -15.24,-16.51 -30.48,-16.51 -30.48,-19.05 -33.02,-19.05 X1.1
  Bottom 1.016: CONNECTOR.5 128.27,53.34 130.81,53.34 135.89,53.34 | 6.35,1.27 6.35,13.97
  Bottom 1.27: 88.9,27.94 92.71,27.94 92.71,33.02 83.82,33.02 82.55,33.02 82.55,38.1 81.28,38.1 IC1.20 | 88.9,27.94 85.09,27.94 | R1.2 C1.2 93.98,24.13 93.98,27.94 88.9,27.94 | CONNECTOR-5.2 6.35,1.27 | 6.35,1.27 CONNECTOR-5.1 | 16.51,76.2 IC2.2 | IC2.2 16.51,71.12 15.24,71.12 15.24,68.58 C5.2 | 144.78,63.5 135.89,63.5 130.81,63.5 CONNECTOR.1 | IC2.2 16.51,80.01 | IC3.4 IC3.5 IC3.12 IC3.13 138.43,-29.21 138.43,-26.67 138.43,10.16 | -2.54,-21.59 IC4.15 | -2.54,-25.4 -2.54,-20.32 -1.27,-20.32 C9.2 3.81,-20.32 SL3.2 | SL3.1 6.35,-3.81 6.35,-1.27 6.35,1.27
  Bottom 1.422: 123.19,25.4 123.19,8.89 | 123.19,8.89 123.19,5.08 | 123.19,5.08 VR.3 | 135.89,53.34 135.89,25.4 130.81,25.4 128.27,25.4 CONNECTOR.16 | 123.19,8.89 R1.2 | 8.89,67.31 SL8.1 | LED2.K -8.89,73.66 -8.89,77.47 -8.89,82.55 16.51,82.55 | 16.51,76.2 16.51,77.47 16.51,80.01 16.51,82.55 | 124.46,77.47 124.46,73.66 CONNECTOR.1 | 16.51,82.55 124.46,82.55 124.46,76.2 | VR.3 129.54,10.16 135.89,10.16 138.43,10.16 144.78,10.16 144.78,63.5 | VR.3 123.19,5.08
  Bottom 1.676: C4.2 6.35,67.31 | 6.35,67.31 8.89,67.31 C5.2 | 6.35,67.31 C3.1
N$73
  Bottom 0.813: IC4.2 -17.78,-21.59 -17.78,-19.05 -26.67,-19.05 -26.67,-26.67 C10.1
N$74  (1 unrouted)
  Bottom 0.406: 87,40.64 87,41.27
  Bottom 0.508: 52.07,60.96 52.07,59.69 52.07,58.42 | 110.49,1.27 110.49,-1.27 | 1.27,13.97 1.27,12.7 1.27,10.16 | -6.35,26.67 -11.43,26.67 | -22.86,-49.53 -24.13,-49.53 | 87.63,15.24 71.12,15.24
  Bottom 0.813: RN.1 49.53,35.56 48.26,36.83 48.26,41.91 | 48.26,41.91 48.26,49.53 33.02,49.53 29.21,49.53 IC1.40 | 127,27.94 132.08,27.94 132.08,30.48 132.08,52.07 127,52.07 123.19,52.07 114.3,52.07 114.3,60.96 | 127,27.94 125.73,27.94 | 48.26,41.91 86.36,41.91 87,41.27 87.63,40.64 | 100.33,27.94 87.63,40.64 | 116.84,27.94 CONNECTOR.15 127,27.94 | 116.84,27.94 100.33,27.94 | -1.27,2.54 -1.27,6.35 1.27,6.35 1.27,10.16 1.27,12.7 1.27,17.78 -1.27,17.78 -8.89,17.78 -11.43,17.78 -11.43,26.67 | 72.39,40.64 78.74,40.64 82.55,40.64 87,40.64 | 71.12,39.37 72.39,40.64 | 71.12,15.24 71.12,39.37 | 127,27.94 116.84,27.94 | 116.84,27.94 100.33,27.94 | 100.33,27.94 87.63,40.64 | 87.63,40.64 72.39,40.64 | 72.39,40.64 71.12,39.37 | 71.12,39.37 71.12,15.24 | 71.12,15.24 88.9,15.24 88.9,3.81 | IC3.1 128.27,-12.7 128.27,-10.16 116.84,-10.16 102.87,-10.16
  Bottom 1.016: CONN-7.2 CONN-7.3 -22.86,7.62 | -1.27,2.54 CONNECTOR-5.4
  Bottom 1.27: CONNECTOR.2 114.3,60.96 | CONN-7.2 CONN-7.1 | -1.27,2.54 -19.05,2.54 -20.32,2.54 -22.86,2.54 -22.86,5.08 -22.86,7.62 | IC3.9 135.89,-41.91 102.87,-41.91 | IC4.16 -7.62,-13.97 -39.37,-13.97 | C10.2 -25.4,-29.21 -25.4,-33.02 -26.67,-33.02 -39.37,-33.02 | 27.94,67.31 29.21,67.31
  Bottom 1.422: 19.05,67.31 IC2.3 | C5.1 19.05,67.31 | IC1.40 RN10.1 29.21,67.31 27.94,67.31 | 27.94,67.31 25.4,67.31 | 27.94,67.31 19.05,67.31 | IC1.31 52.07,59.69 52.07,60.96 59.69,60.96 114.3,60.96 | 110.49,-1.27 110.49,5.08 | 110.49,5.08 110.49,-1.27 | 110.49,-1.27 110.49,5.08 | 110.49,5.08 110.49,-1.27 | 110.49,-1.27 135.89,-1.27 | 135.89,-1.27 VR.1 | 110.49,1.27 C6.2 102.87,-10.16 102.87,-11.43 102.87,-41.91 102.87,-43.18 102.87,-49.53 -22.86,-49.53 -24.13,-49.53 -39.37,-49.53 -39.37,-41.91 -39.37,-33.02 -39.37,-13.97 -39.37,41.91 -36.83,41.91 | 110.49,-1.27 110.49,5.08 | 110.49,5.08 110.49,-1.27 | 88.9,-1.27 S2.4 | 110.49,5.08 105.41,5.08 96.52,5.08 96.52,-11.43 88.9,-11.43 88.9,-6.35 | 88.9,-6.35 88.9,-1.27 | -5.08,38.1 -5.08,26.67 -6.35,26.67 -11.43,26.67 | -24.13,41.91 -11.43,41.91 -5.08,41.91 -5.08,36.83 | 88.9,7.62 88.9,15.24 87.63,15.24 71.12,15.24 | 88.9,-6.35 88.9,-1.27 | 88.9,-1.27 88.9,3.81 88.9,8.89 | 110.49,-1.27 110.49,5.08 | -19.05,41.91 -24.13,41.91 | -24.13,41.91 -26.67,41.91 | -26.67,41.91 -31.75,41.91 -36.83,41.91 | -36.83,41.91 -26.67,41.91 | 135.89,-1.27 IC3.16
N$75
  Bottom 0.508: -33.02,-25.4 X1.3
  Bottom 0.813: IC4.13 -12.7,-26.67 -12.7,-25.4 -13.97,-25.4 -19.05,-25.4 -20.32,-25.4 -20.32,-27.94 -21.59,-27.94 -30.48,-27.94 -30.48,-25.4 -33.02,-25.4
N$76
  Bottom 0.305: -34.29,-15.24 -34.29,-17.78 -34.29,-27.94 -33.02,-27.94
  Bottom 0.508: -33.02,-27.94 X1.4
  Bottom 0.813: IC4.14 -7.62,-22.86 -10.16,-22.86 -10.16,-20.32 -11.43,-20.32 -11.43,-15.24 -31.75,-15.24 -34.29,-15.24
N$77
  Bottom 1.27: SL2.1 IC4.11
N$78
  Bottom 0.813: SL2.2 IC4.12
(copper drawn outside any net)
  shapes: Bottom area x13

### Text on the board
Top: www.compuronicslab.com | + | - | 8051 board with lcd and keypad
Bottom: 8051 board with lcd and keypad | www.compuronicslab.com